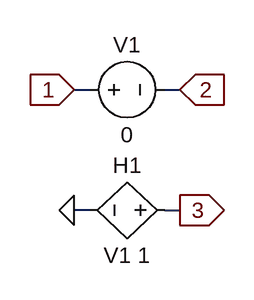
[diagram p0: schematic Isense.asc]
Isense.asc, the LTspice schematic file:
Version 4
SHEET 1 880 680
WIRE 32 96 48 96
WIRE 128 96 144 96
WIRE 128 224 144 224
WIRE 48 224 32 224
FLAG 32 224 0
FLAG 32 96 1
IOPIN 32 96 In
FLAG 144 96 2
IOPIN 144 96 In
FLAG 144 224 3
IOPIN 144 224 Out
SYMBOL h 144 224 R90
WINDOW 0 -32 56 VBottom 0
WINDOW 3 32 56 VTop 0
SYMATTR InstName H1
SYMATTR Value V1 1
SYMBOL voltage 32 96 R270
WINDOW 0 32 56 VTop 0
WINDOW 3 -32 56 VBottom 0
WINDOW 123 -32 56 VBottom 0
WINDOW 39 -32 56 VBottom 0
SYMATTR InstName V1
SYMATTR Value 0

The netlist it stands for:
* Isense.asc
H1 3 0 V1 1
V1 1 2 0
.backanno
.end